# EAGLE design Adafruit TPS61023 (EAGLE 9.6.2)
COMPANY: ADAFRUIT INDUSTRIES; DRAWN: KTOWN; REV: A
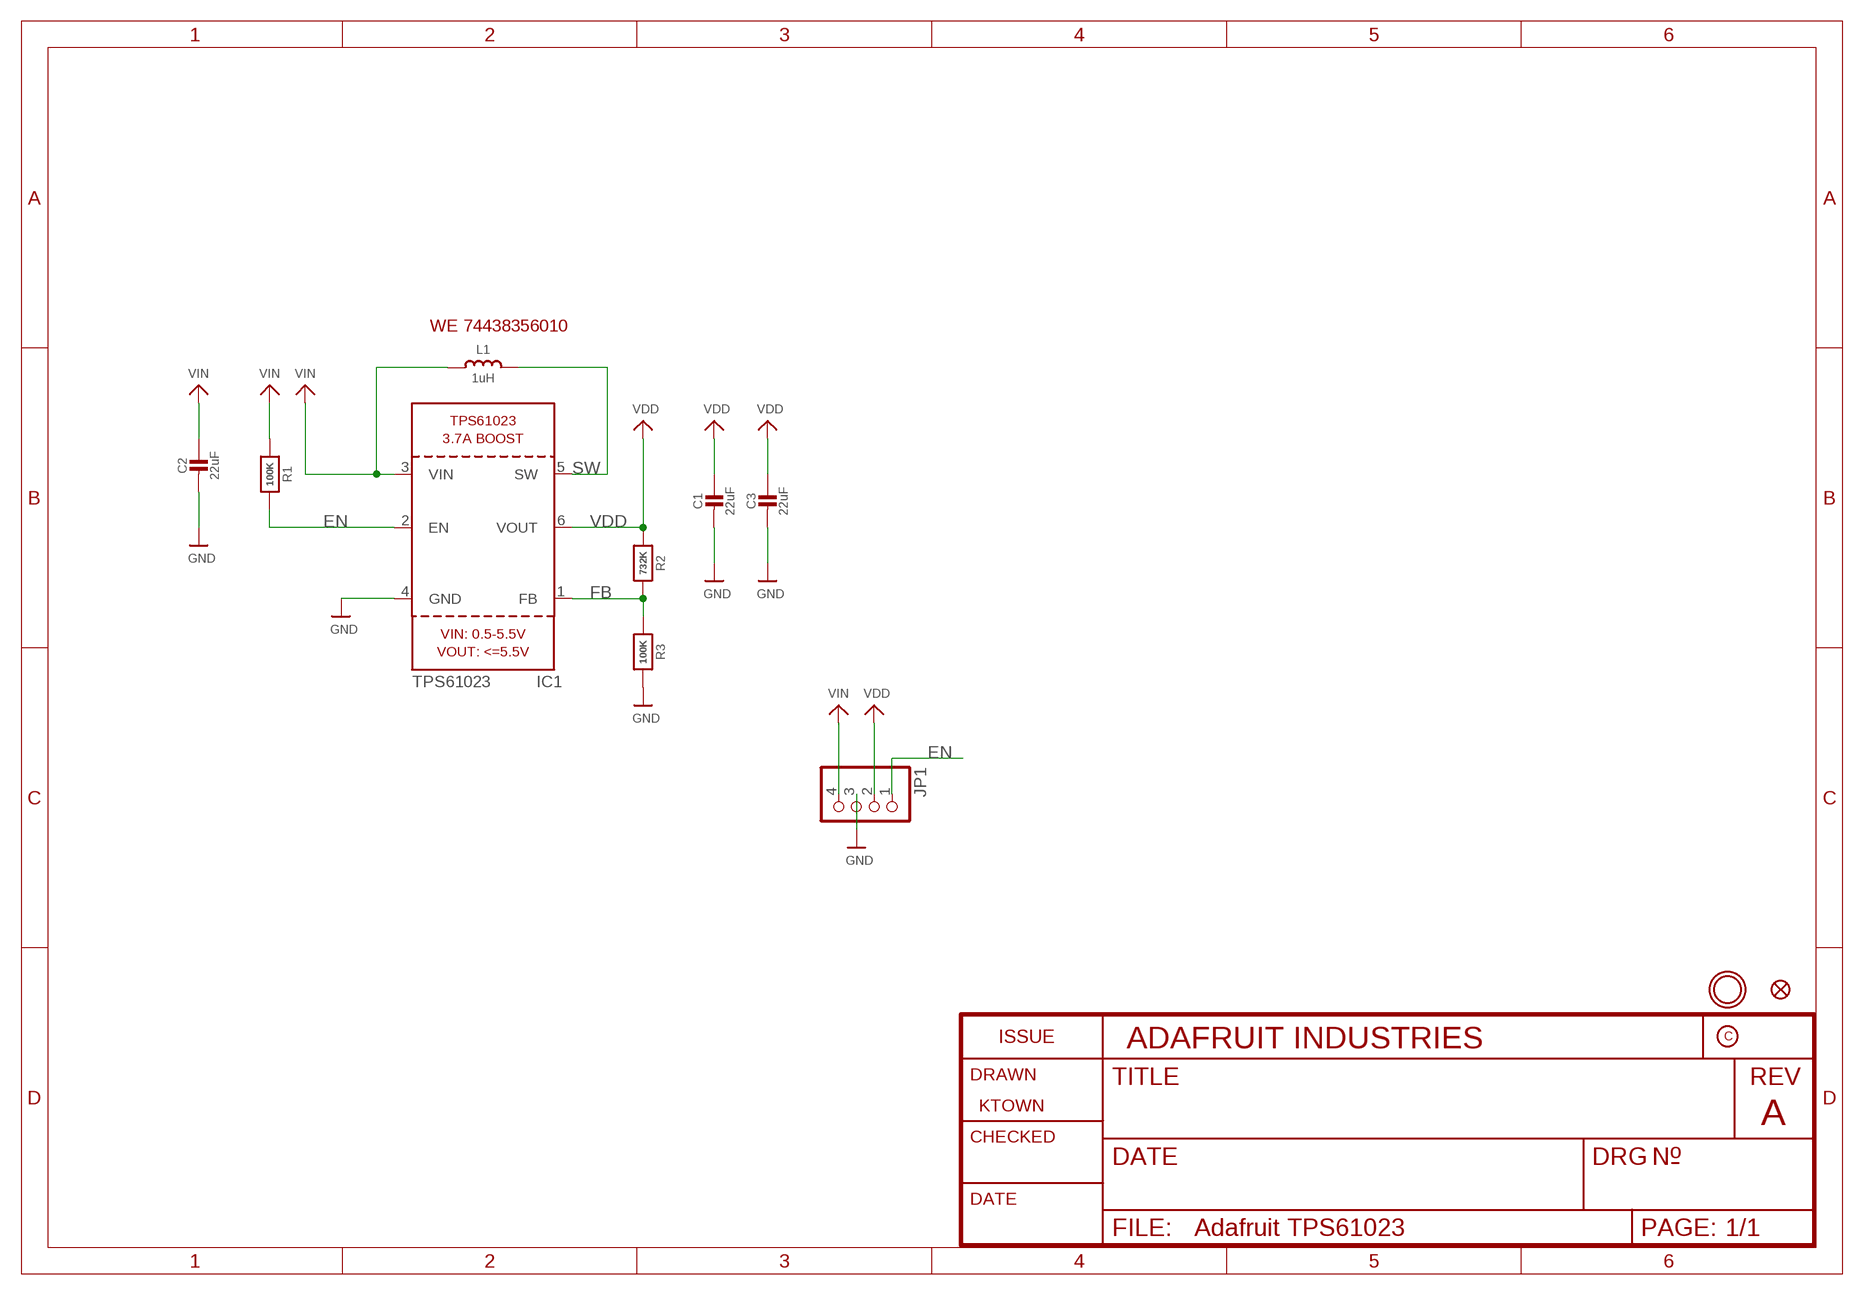
[diagram p0: schematic, sheet 1]

## Parts
C1  22uF  CAP_CERAMIC0805-NOOUTLINE  [0805-NO]
C2  22uF  CAP_CERAMIC0805-NOOUTLINE  [0805-NO]
C3  22uF  CAP_CERAMIC0805-NOOUTLINE  [0805-NO]
FID1  FIDUCIAL_1MM  [FIDUCIAL_1MM]
IC1  TPS61023  [SOT563]
JP1  HEADER-1X4ROUND  [1X04_ROUND]
L1  1uH  INDUCTORTDK_VLC5045  [INDUCTOR_5X5MM_TDK_VLC5045]
R1  100K  RESISTOR_0603_NOOUT  [0603-NO]
R2  732K  RESISTOR_0603_NOOUT  [0603-NO]
R3  100K  RESISTOR_0603_NOOUT  [0603-NO]
U$9  MOUNTINGHOLE2.5  [MOUNTINGHOLE_2.5_PLATED]

## Nets
EN: IC1.2(EN) JP1.1 R1.2
FB: IC1.1(FB) R2.2 R3.1
GND: C1.2 C2.2 C3.2 IC1.4(GND) JP1.3 R3.2
SW: IC1.5(SW) L1.P$2
VDD: C1.1 C3.1 IC1.6(VOUT) JP1.2 R2.1
VIN: C2.1 IC1.3(VIN) JP1.4 L1.P$1 R1.1

## Notes on the sheet
- WE 74438356010

## Library data of the parts
C1-C3 = microbuilder:CAP_CERAMIC: Ceramic Capacitors For new designs, use the packages preceded by an '_' character since they are more reliable: The following footprints should be used on most boards: _0402 - Standard footprint for regular board layouts _0603 - Standard footprint for regular board layouts _0805 - Standard footprint for regular board layouts _1206 - Standard footprint for regular board layouts For extremely tight-pitch boards where space is at a premium, the following 'micro-pitch' footprints can be used (smaller pads, no silkscreen outline, etc.): _0402MP - Micro-pitch footprint for very dense/compact boards _0603MP - Micro-pitch footprint for very dense/compact boards _0805MP - Micro-pitch footprint for very dense/compact boards _1206MP - Micro-pitch footprint for very dense/compact boards
FID1 = microbuilder:FIDUCIAL: Fiducial Alignment Points Various fiducial points for machine vision alignment.; BOM: EXCLUDE
IC1 = adafruit_power:TPS61023
JP1 = microbuilder:HEADER-1X4: PIN HEADER
L1 = microbuilder:INDUCTOR: Inductors 0603: 10nH Ceramic Inductor - microwire antenna/RF (Digikey: 712-1434-2-ND) 0805: 560nH Ceramic Inductor - RF (Digikey: 553-1047-1-ND) 270nH Ceramic Inductor - Q = 40@250MHz, +-5%, 1 Ohm DC Resistance (Digikey: 535-10506-2-ND) 1007 (2518 Metric) SMT: 10µH 10% 250mOhm 820mA 1007 Inductor (Digikey: 587-2189-1-ND) 22µH 10% 500mOhm 580mA 1007 Inductor (Digikey: 587-2190-1-ND) 47µH 10% 950mOhm 420mA 1007 Inductor (Digikey: 587-2191-1-ND) 47µH 5% 100mOhm 1A 1008 Inductor (Digikey: 732-1816-1-ND) 5.0x5.0mm (Taiyo Yuden NR5040 Series) 6.8µH 20% 2.3A 64mOhm Inductor (Digikey: 587-2374-2-ND) 5.0x5.0mm (TDK VLC5045 Series) 4.7µH 20% 3.3A 34mOhm Inductor (Digikey: 445-6526-1-ND) 6.8µH 20% 2.7A 46mOhm Inductor (Digikey: 445-6527-1-ND) 6.0x6.0mm (TDK VLC6045 Series) 4.7µH 20% 3.8A 27mOhm Inductor (Digikey: 445-6538-2-ND) 6.8µH 20% 3A 41mOhm Inductor (Digikey: 445-6540-1-ND) 6.2µH 30% 2.2A 45mOhm Inductor (Digikey: SRR5028-6R2YCT-ND) - Not TDK VLC6045 but footprint should match 6.0x6.0mm (TDK SLF6045 Series) 6.8uH 30% 2A 33mOhm Inductor (Digikey: 445-4572-1-ND, Mouser: 810-SLF645T6R8N2R0PF) 6.0x6.0mm (Sumida CDRH5D28 Series) 6.2uH 30% 1.8A 45mOhm Inductor (Digikey: 308-1542-1-ND) Taiyo Yuden NR3015T2R2M - 2.2uH 20% 1.5A (Digikey: 587-1648-2-ND, Mouser: 963-NR3015T2R2M) - Used with TI TPS62172 CoilCraft RFID Transponder Coil - MA5532-AE (For use with AS3935 Lightning Sensor) Taiyo Yuden NRH2412T2R2MNGH - 2.2uH 20% 1AA (Digikey: 587-3443-1-ND) - Used with TI LM3671 Vishay IHLP 1.0uH Molded Inductor - 24mOhm DCR, 5A, +/-20%, -55°C-125°C (Digikey: 541-1319-1-ND)
R1-R3 = microbuilder:RESISTOR: Resistors For new designs, use the packages preceded by an '_' character since they are more reliable: The following footprints should be used on most boards: _0402 - Standard footprint for regular board layouts _0603 - Standard footprint for regular board layouts _0805 - Standard footprint for regular board layouts _1206 - Standard footprint for regular board layouts For extremely tight-pitch boards where space is at a premium, the following 'micro-pitch' footprints can be used (smaller pads, no silkscreen outline, etc.): _0402MP - Micro-pitch footprint for very dense/compact boards _0603MP - Micro-pitch footprint for very dense/compact boards _0805MP - Micro-pitch footprint for very dense/compact boards _1206MP - Micro-pitch footprint for very dense/compact boards
U$9 = microbuilder:MOUNTINGHOLE: Mounting Hole For #2 screws (0.086"/2.18mm width, 0.094"/2.4mm hole) use 2.5mm; BOM: EXCLUDE

## Board
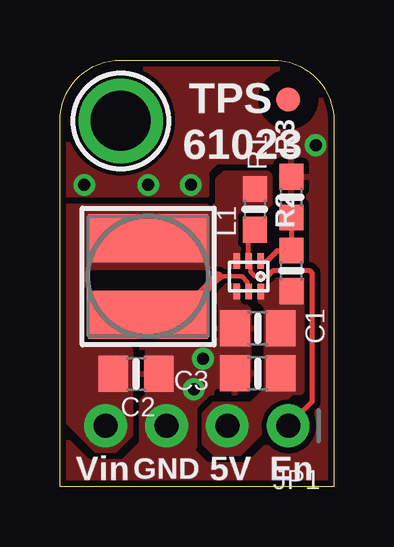
[diagram p1: board, top side]
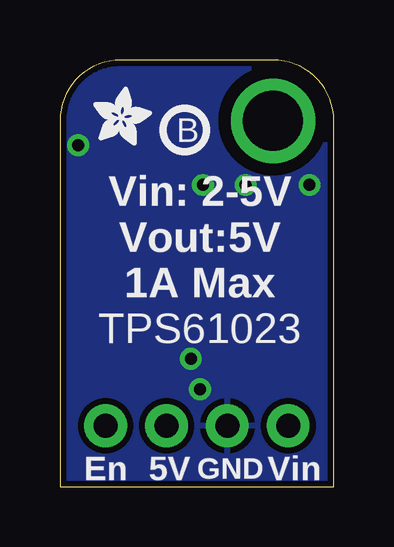
[diagram p2: board, bottom side, seen from below]

Size 11.43 x 17.78 mm. Coordinates in mm from the lower left corner, seen from the top.
Outline: 0,0 0,15.24 arc-90 2.54,17.78 8.89,17.78 arc-90 11.43,15.24 11.43,0 0,0
Copper layers (1*16): Top 0.035mm / dielectric 1.5mm / Bottom 0.035mm
Design rules "adafruit 7-7": minimum track width 6mil, minimum drill 15.5mil, track to track 8mil, track to pad 7mil, pad to pad 7mil, via to via 7mil, smd to smd 7mil, copper to edge 10mil, drill to drill 8mil, minimum pad ring 10mil, minimum via ring 8mil, stop-mask expansion 2mil, vias tented up to drill 20mil, thermal gap 10mil

### Footprints (pad centres in the part's own frame; a part is rotated, then mirrored left to right if it is on the bottom)
0805-NO = smd 1.24 x 1.5: 1 -0.95,0; 2 0.95,0
FIDUCIAL_1MM = smd 1 x 1: 1 0,0
SOT563 = smd 0.65 x 0.275: 1 -0.635,0.5; 2 -0.635,0; 3 -0.635,-0.5; 4 0.635,-0.5; 5 0.635,0; 6 0.635,0.5
1X04_ROUND = drill 1 pad 1.778: 1 -3.81,0; 2 -1.27,0; 3 1.27,0; 4 3.81,0
INDUCTOR_5X5MM_TDK_VLC5045 = smd 2 x 5: P$1 -1.6,0; P$2 1.6,0
0603-NO = smd 1.075 x 1: 1 -0.85,0; 2 0.85,0
MOUNTINGHOLE_2.5_PLATED = drill 2.5 pad 3.2: P$1 0,0

### Placement (x,y rotation side)
C1  8.26,6.6 180 top
C2  3.17,4.7 0 top
C3  8.26,4.72 180 top
FID1  9.53,16.13 0 top
IC1  7.87,8.76 270 top
JP1  5.71,2.54 180 top
L1  3.68,8.76 270 top
R1  8.13,11.56 270 top
R2  9.65,8.99 90 top
R3  9.65,12.06 90 top
U$9  2.54,15.24 0 top
U$10  [PCBFEAT-REV-040]  6.22,14.86 0 bottom
U$11  [ADAFRUIT_2.5MM]  10.03,14.22 0 bottom

### Tracks (layer width: path | path; a pad name or v marks a point on that pad's centre or on a via)
EN
  Top 0.178: IC1.2 7.94,9.34 7.94,8.96 8.13,8.76 8.66,8.76
  Top 0.203: IC1.2 7.87,10.45 R1.2 | JP1.1 10.52,3.53 10.52,8.91 10.41,9.02 8.91,9.02 8.66,8.76
FB
  Top 0.203: IC1.1 8.63,9.4 9.07,9.84 R2.2 R3.1
GND  (via drill 0.5)
  Top 0.254: 7.37,6.67 C1.2
  other vias: 5.97,5.33 10.67,14.22 5.46,12.57 3.68,12.57 1.02,12.57 5.59,4.06
  pour Top (isolate 0.254, rank 6): 0,0 0,17.65 11.43,17.65 11.43,0
  pour Bottom (isolate 0.254, rank 5): 0,0 0,17.65 11.43,17.65 11.43,0
  pour Top (no thermals): 3.43,1.4 3.43,3.56 3.68,3.81 3.68,5.71 3.81,5.84 6.35,5.84 6.73,6.22 6.73,8.13 6.99,8.38 7.49,8.38 7.49,7.75 7.87,7.37 7.87,4.45 7.62,4.19 6.48,4.19 5.59,3.3 5.59,1.65 5.21,1.27 3.56,1.27
SW
  Top 0.178: IC1.5 7.83,8.17 7.83,8.53 7.59,8.76 6.6,8.76
  Top 0.406: 6.6,8.76 5.71,7.87 5.71,7.37 4.32,7.37 4.12,7.16 L1.P$2
VDD
  pour Top (rank 2, no thermals): 5.97,1.91 5.97,3.05 6.35,3.43 8,3.43 8.64,4.06 8.64,7.49 8.38,7.75 8.38,8.38 8.76,8.76 10.03,8.76 10.29,8.51 10.29,4.19 10.03,3.94 9.65,3.94 8.38,2.67 8.38,2.29 7.49,1.4 6.48,1.4
VIN
  Top 0.406: 2.03,4.51 C2.1
  pour Top (no thermals): 7.49,9.14 1.52,9.14 1.27,9.4 1.27,11.18 1.4,11.3 6.1,11.3 6.6,11.81 6.6,12.83 6.86,13.08 8.64,13.08 8.76,12.95 8.76,11.81 8.51,11.56 7.49,11.56
  pour Top (no thermals): 0.25,11.68 6.1,11.68 6.35,11.43 6.35,9.4 6.1,9.14 1.27,9.14 1.02,8.89 1.02,6.1 1.27,5.84 2.79,5.84 2.79,5.71 2.92,5.71 2.92,2.16 2.29,1.52 1.52,1.52 0.25,2.79

### Text on the board
tPlace: TPS / 61023 | Vin | GND | 5V | En
bPlace: Vin: 2-5V / Vout:5V / 1A Max | TPS61023 | Vin | GND | 5V | En